# EAGLE design IrSystem (EAGLE 5.11)
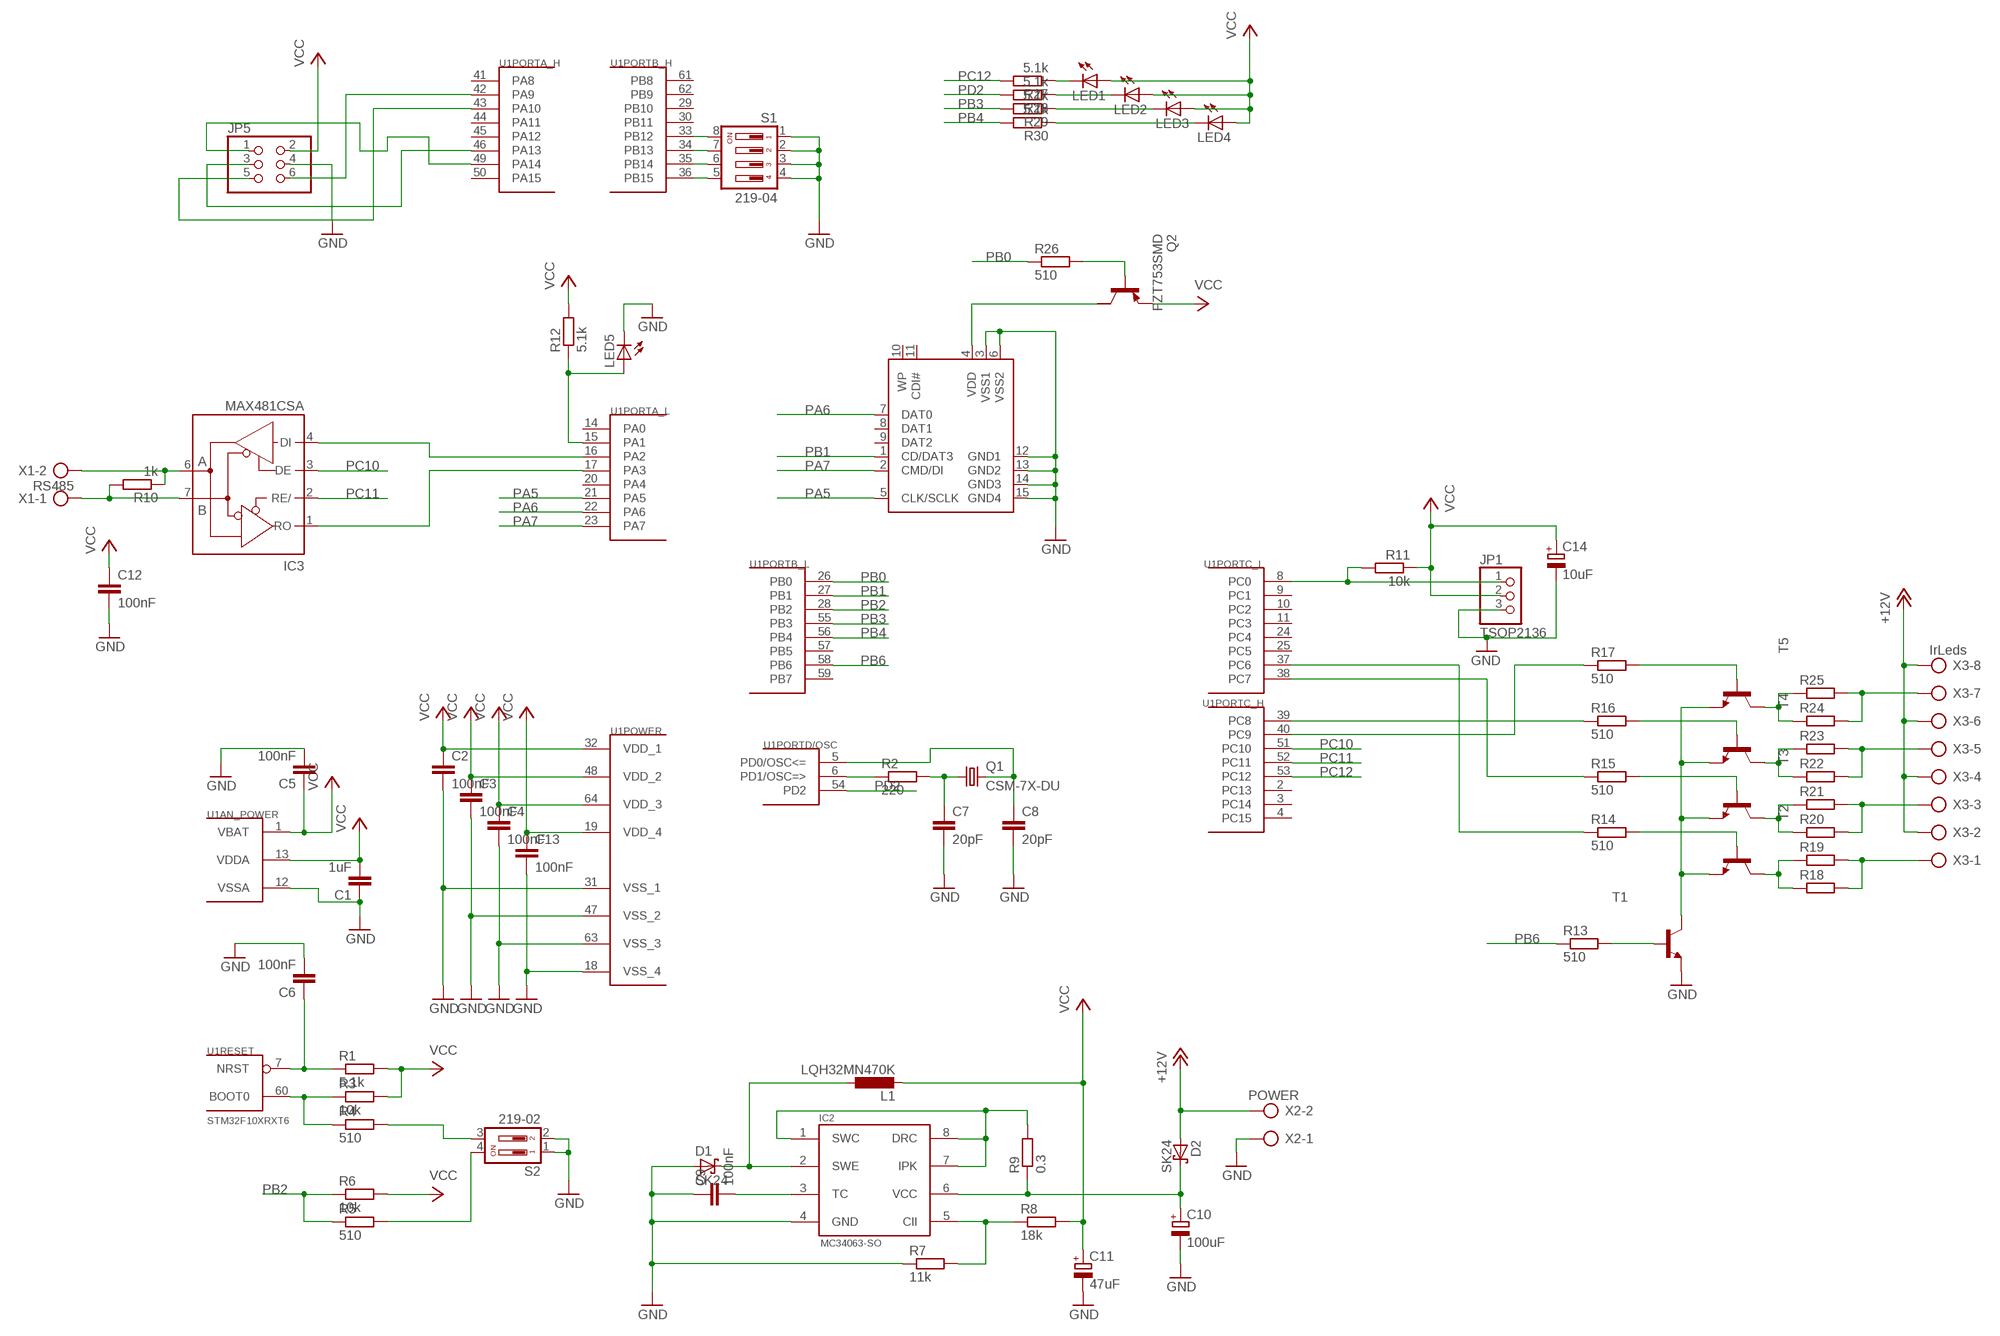
[diagram p0: schematic, sheet 1]

## Parts
C1  1uF  C-EUC0805  [C0805]
C2  100nF  C-EUC0805  [C0805]
C3  100nF  C-EUC0805  [C0805]
C4  100nF  C-EUC0805  [C0805]
C5  100nF  C-EUC0805  [C0805]
C6  100nF  C-EUC0805  [C0805]
C7  20pF  C-EUC0805  [C0805]
C8  20pF  C-EUC0805  [C0805]
C9  100nF  C-EUC0805  [C0805]
C10  100uF  CPOL-EUUD-6,3X7,7  [UD-6,3X7,7_NICHICON]
C11  47uF  CPOL-EUUD-6,3X7,7  [UD-6,3X7,7_NICHICON]
C12  100nF  C-EUC0805  [C0805]
C13  100nF  C-EUC0805  [C0805]
C14  10uF  CPOL-EUUD-6,3X7,7  [UD-6,3X7,7_NICHICON]
D1  SK24  SCHOTTKY-DIODESMD  [SMB]
D2  SK24  SCHOTTKY-DIODESMD  [SMB]
IC2  MC34063-SO  [SO8]
IC3  MAX481CSA  [SO08]
JP1  TSOP2136  PINHD-1X3  [1X03]
JP5  PINHD-2X3  [2X03]
L1  LQH32MN470K  L-EUL1812  [L1812]
LED1  LEDCHIPLED_1206  [CHIPLED_1206]
LED2  LEDCHIPLED_1206  [CHIPLED_1206]
LED3  LEDCHIPLED_1206  [CHIPLED_1206]
LED4  LEDCHIPLED_1206  [CHIPLED_1206]
LED5  LED5MM  [LED5MM]
Q1  CSM-7X-DU  [CSM-7X-DU]
Q2  FZT753SMD  [SOT223]
R1  5.1k  R-EU_R0805  [R0805]
R2  220  R-EU_R0805  [R0805]
R3  10k  R-EU_R0805  [R0805]
R4  510  R-EU_R0805  [R0805]
R5  510  R-EU_R0805  [R0805]
R6  10k  R-EU_R0805  [R0805]
R7  11k  R-EU_R0805  [R0805]
R8  18k  R-EU_R0805  [R0805]
R9  0.3  R-EU_R1206  [R1206]
R10  1k  R-EU_R1206  [R1206]
R11  10k  R-EU_R0805  [R0805]
R12  5.1k  R-EU_R0805  [R0805]
R13  510  R-EU_R0805  [R0805]
R14  510  R-EU_R0805  [R0805]
R15  510  R-EU_R0805  [R0805]
R16  510  R-EU_R0805  [R0805]
R17  510  R-EU_R0805  [R0805]
R18  R-EU_M1206  [M1206]
R19  R-EU_M1206  [M1206]
R20  R-EU_M1206  [M1206]
R21  R-EU_M1206  [M1206]
R22  R-EU_M1206  [M1206]
R23  R-EU_M1206  [M1206]
R24  R-EU_M1206  [M1206]
R25  R-EU_M1206  [M1206]
R26  510  R-EU_R0805  [R0805]
R27  5.1k  R-EU_R0805  [R0805]
R28  5.1k  R-EU_R0805  [R0805]
R29  5.1k  R-EU_R0805  [R0805]
R30  5.1k  R-EU_R0805  [R0805]
S1  219-04  [CTS-219-04]
S2  219-02  [CTS-219-02]
T1  -NPN-SOT223  [SOT223]
T2  -NPN-SOT223  [SOT223]
T3  -NPN-SOT223  [SOT223]
T4  -NPN-SOT223  [SOT223]
T5  -NPN-SOT223  [SOT223]
U1  STM32F10XRXT6  [TQFP64]
U$1  SDCARDVAR2  [SDCMF-10915W010]
X1  RS485  AK500/2  [AK500/2]
X2  POWER  AK500/2  [AK500/2]
X3  IrLeds  AK500/8  [AK500/8]

## Nets
+12V: D2.A X2.2 X3.2 X3.4 X3.6 X3.8
GND: C1.1 C2.2 C3.2 C4.2 C5.2 C6.2 C7.2 C8.2 C9.1 C10.- C11.- C12.2 C13.2 C14.- D1.A IC2.4(GND) JP1.3 JP5.4 LED5.K(C) R7.1 S1.1 S1.2 S1.3 S1.4 S2.1 S2.2 T1.3(E) U1.12(AN_POWER:VSSA) U1.18(POWER:VSS_4) U1.31(POWER:VSS_1) U1.47(POWER:VSS_2) U1.63(POWER:VSS_3) U$1.3(VSS1) U$1.6(VSS2) U$1.12(GND1) U$1.13(GND2) U$1.14(GND3) U$1.15(GND4) X2.1
N$1: S1.5 U1.36(PORTB_H:PB15)
N$2: R2.1 U1.6(PORTD/OSC:PD1/OSC=>)
N$3: C6.1 R1.1 U1.7(RESET:NRST)
N$4: C7.1 Q1.1 R2.2
N$5: C8.1 Q1.2 U1.5(PORTD/OSC:PD0/OSC<=)
N$6: R3.1 R4.1 U1.60(RESET:BOOT0)
N$7: R4.2 S2.3
N$8: R5.2 S2.4
N$9: C9.2 IC2.3(TC)
N$10: C10.+ D2.C IC2.6(VCC) R9.1
N$11: R17.1 U1.40(PORTC_H:PC9)
N$12: IC2.5(CII) R7.2 R8.1
N$13: IC2.1(SWC) IC2.7(IPK) IC2.8(DRC) R9.2
N$14: IC3.7(B) R10.2 X1.1
N$15: IC3.6(A) R10.1 X1.2
N$16: D1.C IC2.2(SWE) L1.1
N$17: S1.6 U1.35(PORTB_H:PB14)
N$18: S1.7 U1.34(PORTB_H:PB13)
N$19: S1.8 U1.33(PORTB_H:PB12)
N$20: IC3.1(RO) U1.17(PORTA_L:PA3)
N$21: IC3.4(DI) U1.16(PORTA_L:PA2)
N$22: Q2.2(C) U$1.4(VDD)
N$23: JP5.3 U1.46(PORTA_H:PA13)
N$24: JP1.1 R11.2 U1.8(PORTC_L:PC0)
N$25: JP5.6 U1.42(PORTA_H:PA9)
N$26: JP5.5 U1.43(PORTA_H:PA10)
N$28: LED5.A R12.1 U1.15(PORTA_L:PA1)
N$29: T1.4(C) T2.3(E) T3.3(E) T4.3(E) T5.3(E)
N$30: R13.2 T1.1(B)
N$31: R14.2 T2.1(B)
N$32: R15.2 T3.1(B)
N$33: R16.2 T4.1(B)
N$34: R17.2 T5.1(B)
N$35: R18.1 R19.1 T2.4(C)
N$36: R16.1 U1.39(PORTC_H:PC8)
N$37: R18.2 R19.2 X3.1
N$38: R15.1 U1.38(PORTC_L:PC7)
N$39: R20.1 R21.1 T3.4(C)
N$40: R20.2 R21.2 X3.3
N$41: R22.2 R23.2 X3.5
N$42: R22.1 R23.1 T4.4(C)
N$43: R24.1 R25.1 T5.4(C)
N$44: R24.2 R25.2 X3.7
N$45: R14.1 U1.37(PORTC_L:PC6)
N$46: JP5.1 U1.49(PORTA_H:PA14)
N$50: LED1.C R27.1
N$51: LED2.C R28.1
N$52: LED3.C R29.1
N$53: LED4.C R30.1
N$60: Q2.1(B) R26.2
PA5: U1.21(PORTA_L:PA5) U$1.5(CLK/SCLK)
PA6: U1.22(PORTA_L:PA6) U$1.7(DAT0)
PA7: U1.23(PORTA_L:PA7) U$1.2(CMD/DI)
PB0: R26.1 U1.26(PORTB_L:PB0)
PB1: U1.27(PORTB_L:PB1) U$1.1(CD/DAT3)
PB2: R5.1 R6.1 U1.28(PORTB_L:PB2)
PB3: R29.2 U1.55(PORTB_L:PB3)
PB4: R30.2 U1.56(PORTB_L:PB4)
PB6: R13.1 U1.58(PORTB_L:PB6)
PC10: IC3.3(DE) U1.51(PORTC_H:PC10)
PC11: IC3.2(RE/) U1.52(PORTC_H:PC11)
PC12: R27.2 U1.53(PORTC_H:PC12)
PD2: R28.2 U1.54(PORTD/OSC:PD2)
VCC: C1.2 C2.1 C3.1 C4.1 C5.1 C11.+ C12.1 C13.1 C14.+ JP1.2 JP5.2 L1.2 LED1.A LED2.A LED3.A LED4.A Q2.3(E) R1.2 R3.2 R6.2 R8.2 R11.1 R12.2 U1.1(AN_POWER:VBAT) U1.13(AN_POWER:VDDA) U1.19(POWER:VDD_4) U1.32(POWER:VDD_1) U1.48(POWER:VDD_2) U1.64(POWER:VDD_3)
Unconnected: Q2.4(C/) U1.2(PORTC_H:PC13) U1.3(PORTC_H:PC14) U1.4(PORTC_H:PC15) U1.9(PORTC_L:PC1) U1.10(PORTC_L:PC2) U1.11(PORTC_L:PC3) U1.14(PORTA_L:PA0) U1.20(PORTA_L:PA4) U1.24(PORTC_L:PC4) U1.25(PORTC_L:PC5) U1.29(PORTB_H:PB10) U1.30(PORTB_H:PB11) U1.41(PORTA_H:PA8) U1.44(PORTA_H:PA11) U1.45(PORTA_H:PA12) U1.50(PORTA_H:PA15) U1.57(PORTB_L:PB5) U1.59(PORTB_L:PB7) U1.61(PORTB_H:PB8) U1.62(PORTB_H:PB9) U$1.8(DAT1) U$1.9(DAT2) U$1.10(WP) U$1.11(CDI#)

## Power pins joined to a net without a drawn wire
GND: IC3.5(GND)
VCC: IC3.8(VCC)

## Library data of the parts
C1-C9 C12 C13 = rcl:C-EU: CAPACITOR, European symbol
C10 C11 C14 = rcl:CPOL-EU: POLARIZED CAPACITOR, European symbol
D1 D2 = diode:SCHOTTKY-DIODE: Schottky Diode
IC2 = mc34063:MC34063-SO: DC/DC converter MC34063 in SO08.
IC3 = maxim:MAX481CSA: RS485 TRANSEIVER; MF: MAXIM; MPN: MAX481CSA; OC_FARNELL: unknown; OC_NEWARK: 90C3817
JP1 = pinhead:PINHD-1X3: PIN HEADER
JP5 = pinhead:PINHD-2X3: PIN HEADER
L1 = rcl:L-EU: INDUCTOR, European symbol
LED1-LED5 = led:LED: LED OSRAM: - CHIPLED LG R971, LG N971, LY N971, LG Q971, LY Q971, LO R971, LY R971 LH N974, LH R974 LS Q976, LO Q976, LY Q976 LO Q996 - Hyper CHIPLED LW Q18S LB Q993, LB Q99A, LB R99A - SideLED LS A670, LO A670, LY A670, LG A670, LP A670 LB A673, LV A673, LT A673, LW A673 LH A674 LY A675 LS A676, LA A676, LO A676, LY A676, LW A676 LS A679, LY A679, LG A679 - Hyper Micro SIDELED® LS Y876, LA Y876, LO Y876, LY Y876 LT Y87S - SmartLED LW L88C, LW L88S LB L89C, LB L89S, LG L890 LS L89K, LO L89K, LY L89K LS L896, LA L896, LO L896, LY L896 - TOPLED LS T670, LO T670, LY T670, LG T670, LP T670 LSG T670, LSP T670, LSY T670, LOP T670, LYG T670 LG T671, LOG T671, LSG T671 LB T673, LV T673, LT T673, LW T673 LH T674 LS T676, LA T676, LO T676, LY T676, LB T676, LH T676, LSB T676, LW T676 LB T67C, LV T67C, LT T67C, LS T67K, LO T67K, LY T67K, LW E67C LS E67B, LA E67B, LO E67B, LY E67B, LB E67C, LV E67C, LT E67C LW T67C LS T679, LY T679, LG T679 LS T770, LO T770, LY T770, LG T770, LP T770 LB T773, LV T773, LT T773, LW T773 LH T774 LS E675, LA E675, LY E675, LS T675 LS T776, LA T776, LO T776, LY T776, LB T776 LHGB T686 LT T68C, LB T68C - Hyper Mini TOPLED® LB M676 - Mini TOPLED Santana® LG M470 LS M47K, LO M47K, LY M47K Source: http://www.osram.convergy.de LUXEON: - LUMILED® LXK2-PW12-R00, LXK2-PW12-S00, LXK2-PW14-U00, LXK2-PW14-V00 LXK2-PM12-R00, LXK2-PM12-S00, LXK2-PM14-U00 LXK2-PE12-Q00, LXK2-PE12-R00, LXK2-PE12-S00, LXK2-PE14-T00, LXK2-PE14-U00 LXK2-PB12-K00, LXK2-PB12-L00, LXK2-PB12-M00, LXK2-PB14-N00, LXK2-PB14-P00, LXK2-PB14-Q00 LXK2-PR12-L00, LXK2-PR12-M00, LXK2-PR14-Q00, LXK2-PR14-R00 LXK2-PD12-Q00, LXK2-PD12-R00, LXK2-PD12-S00 LXK2-PH12-R00, LXK2-PH12-S00 LXK2-PL12-P00, LXK2-PL12-Q00, LXK2-PL12-R00 Source: www.luxeon.com KINGBRIGHT: KA-3528ASYC Source: www.kingbright.com
Q1 = crystal:CSM-7X-DU: SMD CRYSTAL Source: www.ecsxtal.com .. Crystal 3.6864MHz CSM_7X_DU.PDF; OC_FARNELL: unknown; OC_NEWARK: unknown
Q2 = transistor-pnp:FZT753SMD: PNP Transistor
R1-R30 = rcl:R-EU_: RESISTOR, European symbol
S1 = switch-dil:219-04*: Surface Mount DIP Switch Series 219 SMT CTS Electronic Components Sourc: www.ctscorp.com; OC_FARNELL: unknown; OC_NEWARK: unknown
S2 = switch-dil:219-02*: Surface Mount DIP Switch Series 219 SMT CTS Electronic Components Sourc: www.ctscorp.com; OC_FARNELL: unknown; OC_NEWARK: unknown
T1-T5 = transistor-neu-to92:*-NPN-: NPN Transistror
U1 = stm32:STM32F10XRXT6: STM32F101/103 64pin LQFP
U$1 = kingfont_sdcmf10915w010_covek:SDCARD: SD card connector KINGFONT SDCMF-10915W010
X1 X2 = con-ptr500:AK500/2: CONNECTOR; OC_FARNELL: unknown; OC_NEWARK: unknown
X3 = con-ptr500:AK500/8: CONNECTOR; OC_FARNELL: unknown; OC_NEWARK: unknown

## Board
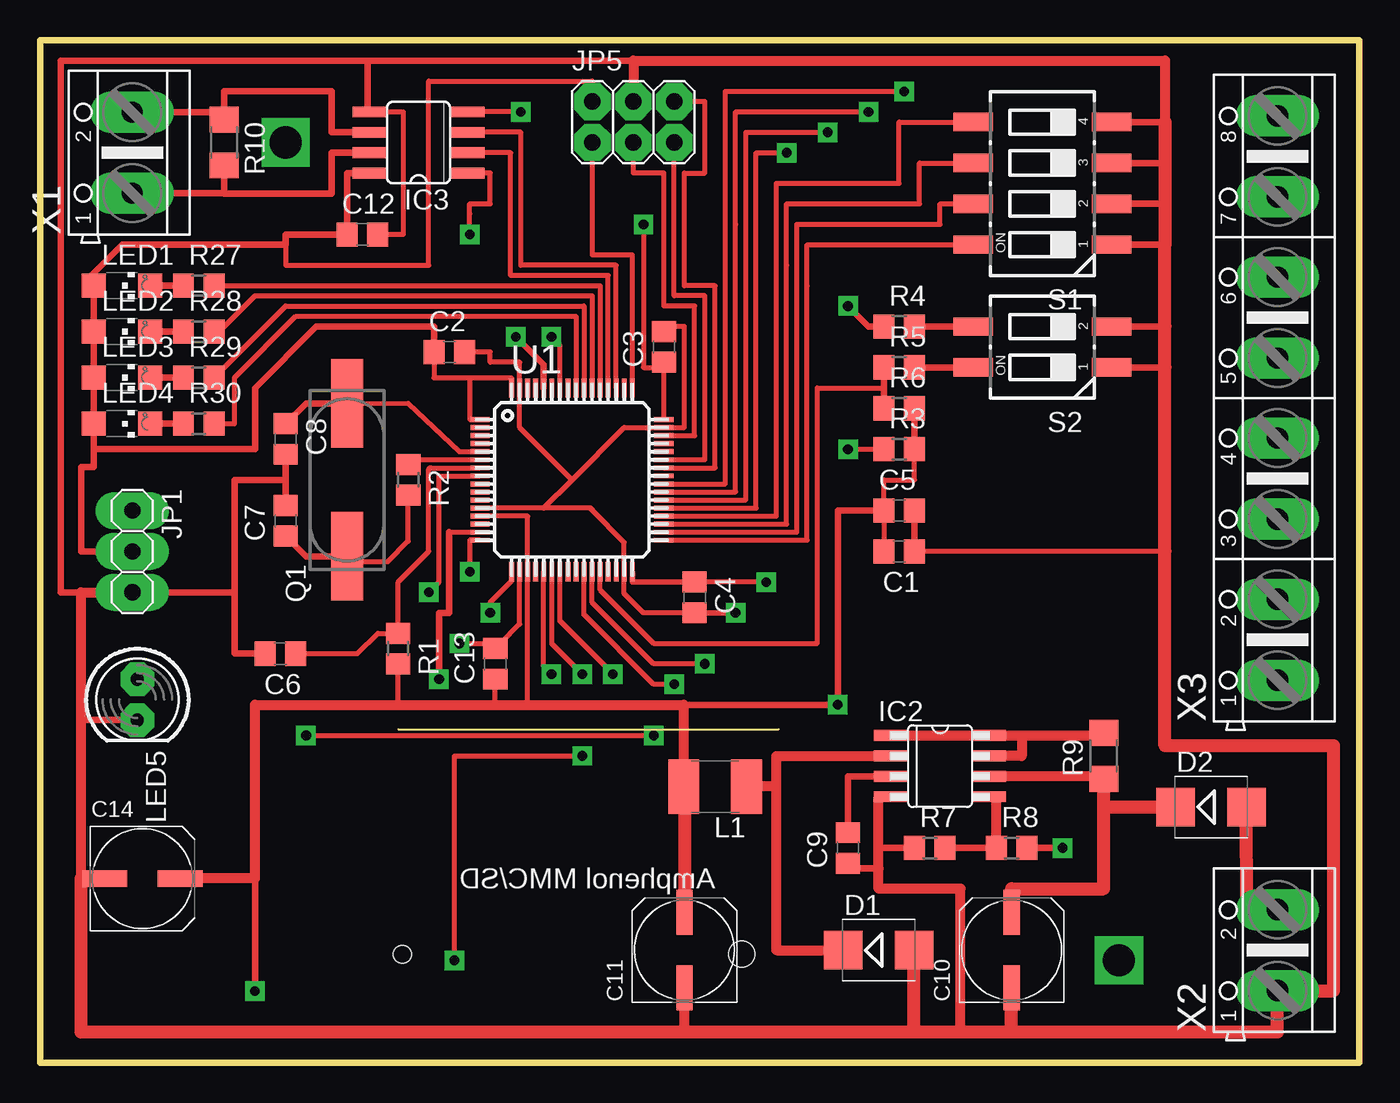
[diagram p1: board, top side]
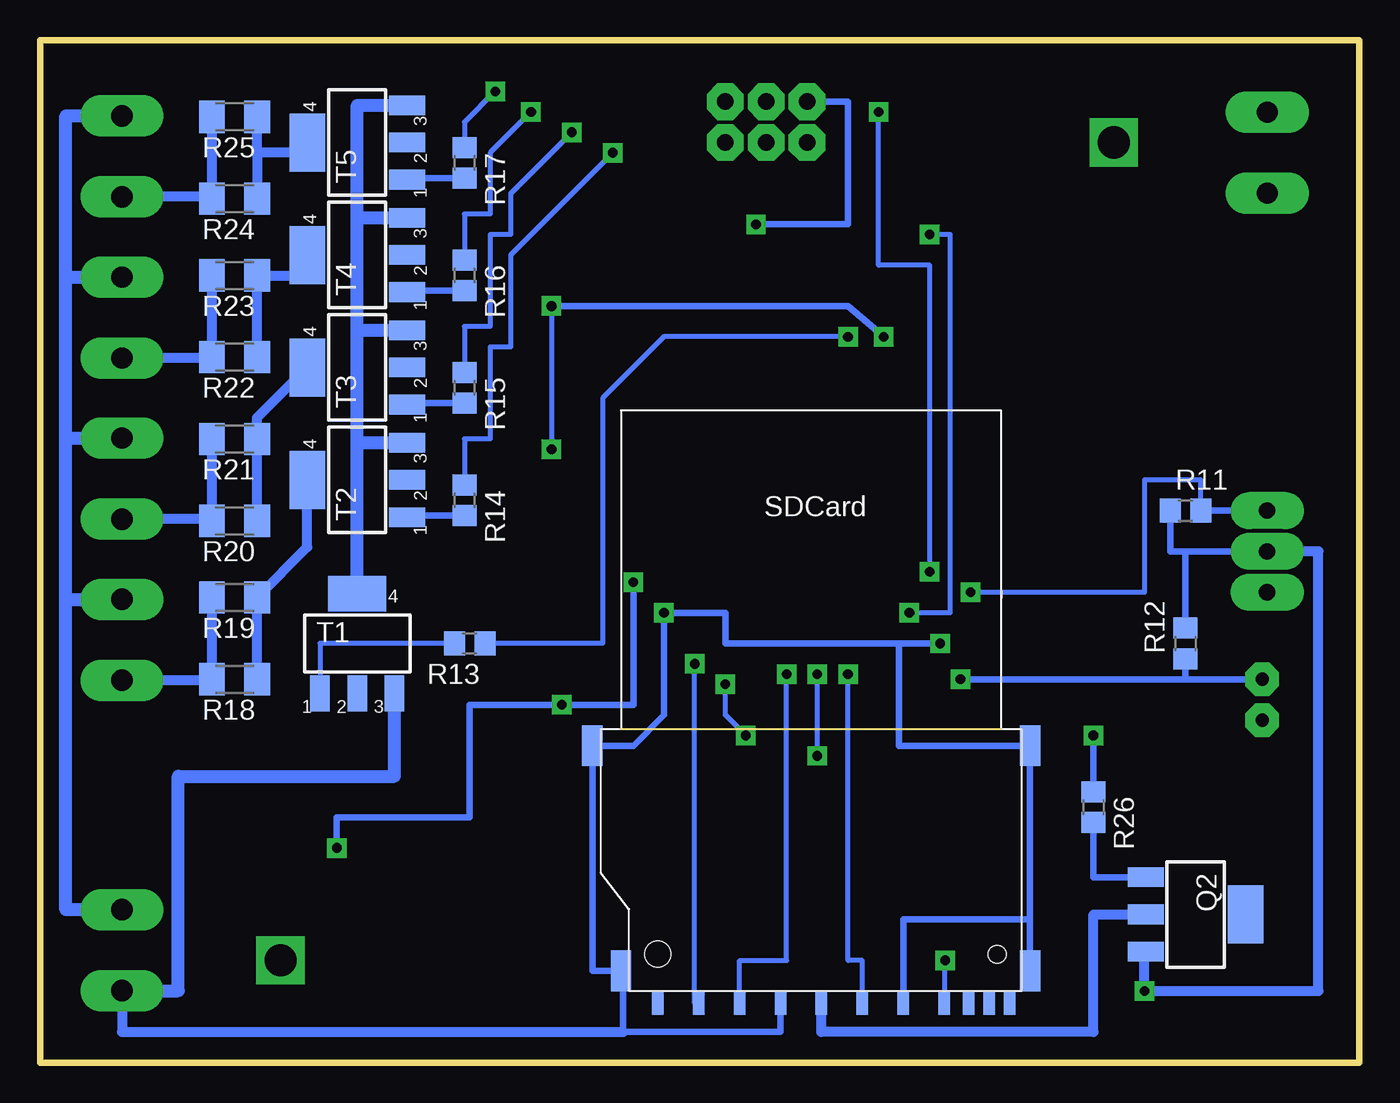
[diagram p2: board, bottom side, seen from below]

Size 81.92 x 63.5 mm. Coordinates in mm from the lower left corner, seen from the top.
Outline: 0,0 81.92,0 81.92,63.5 0,63.5 0,0
Copper layers (1*16): Top 0.035mm / dielectric 1.5mm / Bottom 0.035mm
Design rules "default": minimum track width 20mil, minimum drill 32mil, track to track 12mil, track to pad 12mil, pad to pad 12mil, via to via 12mil, smd to smd 8mil, copper to edge 40mil, drill to drill 40mil, minimum pad ring 25mil, minimum via ring 12mil, stop-mask expansion 4mil, vias tented up to drill 0mil, thermal gap 10mil

### Footprints (pad centres in the part's own frame; a part is rotated, then mirrored left to right if it is on the bottom)
C0805 = smd 1.3 x 1.5: 1 -0.95,0; 2 0.95,0
UD-6,3X7,7_NICHICON = smd 2.8 x 1: + 2.35,0; - -2.35,0
SMB = smd 2.4 x 2.4: A 2.2,0; C -2.2,0
SO8 = smd 0.66 x 2.032: 1 -1.905,-3.073; 2 -0.635,-3.073; 3 0.635,-3.073; 4 1.905,-3.073; 5 1.905,3.073; 6 0.635,3.073; 7 -0.635,3.073; 8 -1.905,3.073
SO08 = smd 0.66 x 2.032: 1 -1.905,-3.073; 2 -0.635,-3.073; 3 0.635,-3.073; 4 1.905,-3.073; 5 1.905,3.073; 6 0.635,3.073; 7 -0.635,3.073; 8 -1.905,3.073
1X03 = drill 1.016 long: 1 -2.54,0; 2 0,0; 3 2.54,0
2X03 = drill 1.016 octagon: 1 -2.54,-1.27; 2 -2.54,1.27; 3 0,-1.27; 4 0,1.27; 5 2.54,-1.27; 6 2.54,1.27
L1812 = smd 1.9 x 3.4: 1 -1.95,0; 2 1.95,0
CHIPLED_1206 = smd 1.5 x 1.5: A 0,-1.75; C 0,1.75
LED5MM = drill 0.813 octagon: A -1.27,0; K 1.27,0
CSM-7X-DU = smd 5.5 x 2: 1 -4.75,0; 2 4.75,0
SOT223 = smd 1.219 x 2.235: 1 -2.311,-3.099; 2 0,-3.099; 3 2.311,-3.099 | smd 3.6 x 2.2: 4 0,3.099
R0805 = smd 1.3 x 1.5: 1 -0.95,0; 2 0.95,0
R1206 = smd 1.6 x 1.803: 1 -1.422,0; 2 1.422,0
M1206 = smd 1.6 x 2: 1 -1.4,0; 2 1.4,0
CTS-219-04 = smd 1.13 x 2.44: 1 -3.81,-4.3; 2 -1.27,-4.3; 3 1.27,-4.3; 4 3.81,-4.3; 5 3.81,4.3; 6 1.27,4.3; 7 -1.27,4.3; 8 -3.81,4.3
CTS-219-02 = smd 1.13 x 2.44: 1 -1.27,-4.3; 2 1.27,-4.3; 3 1.27,4.3; 4 -1.27,4.3
TQFP64 = smd 1.2 x 0.3: 1 -5.7,3.75; 2 -5.7,3.25; 3 -5.7,2.75; 4 -5.7,2.25; 5 -5.7,1.75; 6 -5.7,1.25; 7 -5.7,0.75; 8 -5.7,0.25; 9 -5.7,-0.25; 10 -5.7,-0.75; 11 -5.7,-1.25; 12 -5.7,-1.75; 13 -5.7,-2.25; 14 -5.7,-2.75; 15 -5.7,-3.25; 16 -5.7,-3.75; 33 5.7,-3.75; 34 5.7,-3.25; 35 5.7,-2.75; 36 5.7,-2.25; 37 5.7,-1.75; 38 5.7,-1.25; 39 5.7,-0.75; 40 5.7,-0.25; 41 5.7,0.25; 42 5.7,0.75; 43 5.7,1.25; 44 5.7,1.75; 45 5.7,2.25; 46 5.7,2.75; 47 5.7,3.25; 48 5.7,3.75 | smd 0.3 x 1.2: 17 -3.75,-5.7; 18 -3.25,-5.7; 19 -2.75,-5.7; 20 -2.25,-5.7; 21 -1.75,-5.7; 22 -1.25,-5.7; 23 -0.75,-5.7; 24 -0.25,-5.7; 25 0.25,-5.7; 26 0.75,-5.7; 27 1.25,-5.7; 28 1.75,-5.7; 29 2.25,-5.7; 30 2.75,-5.7; 31 3.25,-5.7; 32 3.75,-5.7; 49 3.75,5.7; 50 3.25,5.7; 51 2.75,5.7; 52 2.25,5.7; 53 1.75,5.7; 54 1.25,5.7; 55 0.75,5.7; 56 0.25,5.7; 57 -0.25,5.7; 58 -0.75,5.7; 59 -1.25,5.7; 60 -1.75,5.7; 61 -2.25,5.7; 62 -2.75,5.7; 63 -3.25,5.7; 64 -3.75,5.7
SDCMF-10915W010 = smd 0.711 x 1.422: 1 7.366,13.462; 2 4.826,13.462; 3 2.286,13.462; 4 -0.254,13.462; 5 -2.794,13.462; 6 -5.334,13.462; 7 -7.874,13.462; 8 -9.398,13.462; 9 9.906,13.462; 10 -11.938,13.462; 11 -10.668,13.462 | smd 1.27 x 2.54: 12 12.192,11.43; 13 13.97,-2.54; 14 -13.208,-2.54; 15 -13.208,11.43 | hole 1.6: 9.906,10.414 | hole 1.1: -11.176,10.414
AK500/2 = drill 1.321 long: 1 -2.515,0; 2 2.515,0
AK500/8 = drill 1.321 long: 1 -17.526,0; 2 -12.497,0; 3 -7.518,0; 4 -2.489,0; 5 2.489,0; 6 7.518,0; 7 12.497,0; 8 17.526,0

### Placement (x,y rotation side)
C1  53.34,31.75 180 top
C2  25.4,44.13 0 top
C3  38.73,44.45 90 top
C4  40.64,28.89 270 top
C5  53.34,34.29 0 top
C6  14.92,25.4 180 top
C7  15.24,33.66 90 top
C8  15.24,38.73 270 top
C9  50.16,13.34 90 top
C10  60.33,6.99 90 top
C11  40.01,6.99 90 top
C12  20,51.44 0 top
C13  28.26,24.77 90 top
C14  6.35,11.43 0 top
D1  52.07,6.99 0 top
D2  72.71,15.88 0 top
IC2  55.88,18.41 270 top
IC3  23.5,57.15 90 top
JP1  5.71,31.75 270 top
JP5  36.83,58.42 0 top
L1  41.91,17.14 180 top
LED1  5.08,48.26 270 top
LED2  5.08,45.4 270 top
LED3  5.08,42.55 270 top
LED4  5.08,39.69 270 top
LED5  6.03,22.54 270 top
Q1  19.05,36.2 90 top
Q2  10.16,9.21 270 bottom
R1  22.23,25.72 270 top
R2  22.86,36.2 270 top
R3  53.34,38.1 0 top
R4  53.34,45.72 0 top
R5  53.34,43.18 0 top
R6  53.34,40.64 0 top
R7  55.24,13.34 0 top
R8  60.33,13.34 0 top
R9  66.04,19.05 90 top
R10  11.43,57.15 270 top
R11  10.79,34.29 0 bottom
R12  10.79,26.04 90 bottom
R13  55.24,26.04 180 bottom
R14  55.56,34.92 270 bottom
R15  55.56,41.91 270 bottom
R16  55.56,48.9 270 bottom
R17  55.56,55.88 270 bottom
R18  69.85,23.81 180 bottom
R19  69.85,28.89 180 bottom
R20  69.85,33.66 180 bottom
R21  69.85,38.73 180 bottom
R22  69.85,43.81 180 bottom
R23  69.85,48.9 180 bottom
R24  69.85,53.66 180 bottom
R25  69.85,58.74 180 bottom
R26  16.51,15.88 270 bottom
R27  9.84,48.26 0 top
R28  9.84,45.4 0 top
R29  9.84,42.55 0 top
R30  9.84,39.69 0 top
S1  62.23,54.61 90 top
S2  62.23,44.45 90 top
T1  62.23,26.04 0 bottom
T2  62.23,36.2 90 bottom
T3  62.23,43.18 90 bottom
T4  62.23,50.16 90 bottom
T5  62.23,57.15 90 bottom
U1  33.02,36.2 0 top
U$1  33.66,17.14 180 bottom
X1  5.71,56.52 90 top
X2  76.83,6.99 90 top
X3  76.83,41.27 90 top

### Tracks (layer width: path | path; a pad name or v marks a point on that pad's centre or on a via)
+12V
  Top 0.813: X2.2 74.93,9.5 D2.A
  Bottom 0.813: 80.33,28.78 80.33,9.5 X2.2 | 80.33,28.78 X3.2 | 80.33,28.78 80.33,38.79 | X3.8 80.33,58.8 80.33,48.79 | 80.33,48.79 X3.6 | 80.33,38.79 80.33,48.79 | 80.33,38.79 X3.4
GND  (via drill 0.6)
  Top 0.305: 31.27,34.45 U1.12 | 31.27,34.45 33.02,36.2 | 33.02,36.2 29.77,39.45 U1.63 29.77,43.5 27.94,43.5 27.94,44.13 C2.2 26.35,44.45 26.04,44.45 | 33.02,36.2 36.27,39.45 U1.47 40.01,39.45 40.01,45.72 38.73,45.72 C3.2 | 34.29,34.29 34.13,34.45 | 69.85,31.75 C1.1 | C13.2 | 28.57,26.04 C13.2 | C13.2 27.94,25.4 27.94,26.04 v26.04,26.04 28.57,26.04 | U1.18 29.77,27.23 28.57,26.04 | 34.13,34.45 31.27,34.45 | 34.29,34.29 arc90 34.13,34.45 | 34.29,34.29 36.27,32.31 U1.31 36.27,29.14 37.46,27.94 C4.2 v43.18,27.94 | 52.07,16.51 IC2.4 | C12.2 22.54,51.44 22.54,59.05 IC3.5
  Top 0.406: C1.1 C5.2 | 69.85,58.42 S1.4 | 69.85,55.88 S1.3 | 69.85,53.34 S1.2 | 69.85,50.8 S1.1 | 69.85,45.72 S2.2 | 69.85,43.18 S2.1 | 52.07,13.34 R7.1 | C9.1 50.16,12.06 52.07,12.06 | 2.54,11.43 C14.- | 2.54,21.27 LED5.K | JP1.3 12.06,29.21 | 12.06,29.21 12.06,36.2 15.24,36.2 | 2.54,29.21 1.27,29.21 1.27,62.23 20.32,62.23 | 20.32,62.23 36.83,62.23 | 12.06,29.21 12.06,25.4 C6.2 | 15.24,36.2 C7.2 | 15.24,36.2 C8.2 | IC3.5 20.32,59.05 20.32,62.23
  Top 0.61: 40.01,1.91 C11.- | 52.07,16.51 52.07,13.34 52.07,12.06 52.07,10.79 57.15,10.79 57.15,1.91 | 2.54,11.43 2.54,21.27 2.54,29.21 JP1.3 | JP5.4 36.83,62.23 69.85,62.23 69.85,58.42
  Top 0.813: 60.33,1.91 76.83,1.91 X2.1 80.33,4.47 80.33,19.68 69.85,19.68 69.85,31.75 69.85,43.18 69.85,45.72 69.85,50.8 69.85,53.34 69.85,55.88 69.85,58.42 | 60.33,1.91 C10.- | 2.54,11.43 2.54,1.91 40.01,1.91 54.27,1.91 | 60.33,1.91 57.15,1.91 54.27,1.91 | 54.27,1.91 D1.A
  Bottom 0.305: 45.72,5.71 U$1.12
  Bottom 0.406: U$1.12 47.62,5.71 U$1.13 45.09,19.68 43.18,21.59 v43.18,27.94 39.37,27.94 39.37,26.04 28.57,26.04 | 20.45,8.89 U$1.15 | 20.45,8.89 U$1.14 28.57,19.68 28.57,26.04 | U$1.3 35.94,1.91 45.72,1.91 45.72,5.71 | 28.57,26.04 v26.04,26.04 | U$1.6 28.32,8.89 20.45,8.89
  Bottom 0.61: X2.1 76.83,1.91 45.72,1.91
  Bottom 0.813: X2.1 73.34,4.47 73.34,17.78 59.92,17.78 T1.3
N$1
  Top 0.305: S1.5 53.34,58.42 53.34,54.61 45.72,54.61 45.72,50.16 45.72,33.95 U1.36
N$2
  Top 0.305: U1.6 23.16,37.45 arc90 R2.1
N$3
  Top 0.305: U1.7 24.25,36.95 arc90 24.13,36.83 24.13,31.75 22.23,29.84 R1.1 20.95,26.67 19.68,25.4 C6.1
N$4
  Top 0.305: 19.04,31.43 arc90 Q1.1 19.38,31.11 21.59,31.11 22.86,32.38 R2.2
  Top 0.406: Q1.1 16.5,31.45 C7.1
N$5
  Top 0.305: U1.5 26.04,37.95 22.86,40.96 Q1.2
  Top 0.406: Q1.2 16.5,40.95 C8.1
N$6  (via drill 0.6)
  Top 0.305: v50.16,38.1 R3.1
  Top 0.406: R4.1 51.44,45.72 v50.16,46.99 | v29.53,45.09 31.27,43.34 U1.60
  Bottom 0.305: v50.16,46.99 v50.16,38.1
  Bottom 0.406: v50.16,46.99 31.75,46.99 v29.53,45.09
N$7
  Top 0.406: R4.2 S2.3
N$8
  Top 0.406: R5.2 S2.4
N$9
  Top 0.406: C9.2 50.16,17.78 IC2.3
N$10
  Top 0.406: R9.1 66.04,17.78
  Top 0.61: 66.04,17.78 IC2.6
  Top 0.813: C10.+ 60.33,10.79 66.04,10.79 66.04,15.88 | 66.04,15.88 R9.1 | 66.04,15.88 D2.C
N$11  (via drill 0.6)
  Top 0.305: v53.66,60.33 42.55,60.33 42.55,52.7 42.55,35.95 U1.40
  Bottom 0.305: R17.1 55.56,58.42 v53.66,60.33
N$12
  Top 0.406: 59.38,16.51 IC2.5 | R7.2 R8.1
  Top 0.61: R8.1 59.38,16.51
N$13
  Top 0.406: 66.04,20.32 R9.2
  Top 0.61: IC2.1 IC2.8 60.96,20.32 | 60.96,20.32 60.96,19.05 IC2.7 | 60.96,20.32 66.04,20.32
N$14
  Top 0.406: X1.1 11.43,54 | IC3.7 18.1,56.52 18.1,53.98 11.43,53.98 11.43,54 | 11.43,54 R10.2
N$15
  Top 0.406: X1.2 10.79,59.03 R10.1 11.43,60.33 18.1,60.33 18.1,57.78 IC3.6
N$16
  Top 0.61: D1.C 45.72,6.99 45.72,17.14 | 45.72,17.14 L1.1 | IC2.2 45.72,19.05 45.72,17.14
N$17
  Top 0.305: S1.6 54.61,55.88 54.61,53.34 46.35,53.34 46.35,49.53 46.35,33.45 U1.35
N$18
  Top 0.305: S1.7 55.88,53.34 55.88,52.07 46.99,52.07 46.99,48.9 46.99,32.95 U1.34
N$19
  Top 0.305: S1.8 47.62,50.8 47.62,48.26 47.62,32.45 U1.33
N$20  (via drill 0.6)
  Top 0.305: IC3.1 27.94,55.24 27.94,53.34 26.67,53.34 26.67,52.7 v26.67,51.44 | v27.94,27.94 27.94,28.57 29.27,29.91 U1.17
  Bottom 0.305: v26.67,51.44 25.4,51.44 25.4,27.94 v27.94,27.94
N$21  (via drill 0.6)
  Top 0.305: v29.84,59.05 IC3.4 | v26.67,30.48 26.67,32.45 U1.16
  Bottom 0.305: v26.67,30.48 26.67,49.53 29.84,49.53 v29.84,59.05
N$22
  Bottom 0.61: Q2.2 16.51,9.21 16.51,1.91 33.4,1.91 U$1.4
N$23
  Top 0.305: JP5.3 36.83,55.24 38.73,55.24 38.73,46.99 40.64,46.99 40.64,38.95 U1.46
N$24  (via drill 0.6)
  Top 0.305: U1.8 24.77,36.45 24.77,29.84 v24.13,29.21
  Bottom 0.305: v24.13,29.21 13.34,29.21 13.34,36.2 9.85,36.2 R11.2
  Bottom 0.406: JP1.1 R11.2
N$25
  Top 0.305: JP5.6 41.27,59.69 41.27,55.24 40.01,55.24 40.01,48.26 41.91,48.26 41.91,36.95 U1.42
N$26
  Top 0.305: JP5.5 39.37,47.62 41.27,47.62 41.27,37.45 U1.43
N$27
  Top 0.305: 40.64,27.94 43.18,27.94
N$28  (via drill 0.6)
  Top 0.305: 25.4,32.95 U1.15
  Top 0.406: 25.4,32.95 25.4,27.94 24.77,27.94 v24.77,23.81
  Bottom 0.305: R12.1 arc90 11.12,24.77
  Bottom 0.406: LED5.A 10.79,23.81 | 10.79,23.81 R12.1 | 10.79,23.81 v24.77,23.81
N$29
  Bottom 0.813: 62.23,38.51 T2.3 | 62.23,45.49 T3.3 | 62.23,38.51 62.23,45.49 | 62.23,52.48 T4.3 | 62.23,45.49 62.23,52.48 | T1.4 62.23,38.51 | 62.23,52.48 62.23,59.46 T5.3
N$30
  Bottom 0.305: R13.2 64.54,26.04 T1.1
N$31
  Bottom 0.406: T2.1 59.13,33.98 R14.2
N$32
  Bottom 0.406: T3.1 59.13,40.96 R15.2
N$33
  Bottom 0.406: T4.1 59.13,47.95 R16.2
N$34
  Bottom 0.406: T5.1 59.13,54.93 R17.2
N$35
  Bottom 0.61: R18.1 R19.1 65.33,32.01 65.33,36.83 T2.4
N$36  (via drill 0.6)
  Top 0.305: v51.44,59.05 43.18,59.05 43.18,52.07 43.18,35.45 U1.39
  Bottom 0.305: R16.1 55.56,52.7 53.98,52.7 53.98,56.52 v51.44,59.05
N$37
  Bottom 0.406: R18.2 71.25,23.75
  Bottom 0.61: R18.2 R19.2 | 71.25,23.75 X3.1
N$38  (via drill 0.6)
  Top 0.305: v48.9,57.78 43.81,57.78 43.81,51.44 43.81,34.95 U1.38
  Bottom 0.305: R15.1 55.56,45.72 53.98,45.72 53.98,51.44 52.7,51.44 52.7,53.98 v48.9,57.78
N$39
  Bottom 0.61: R20.1 R21.1 68.45,40.06 T3.4 65.33,44.45
N$40
  Bottom 0.406: R20.2 71.25,33.76
  Bottom 0.61: R20.2 R21.2 | 71.25,33.76 X3.3
N$41
  Bottom 0.406: R22.2 71.57,43.76
  Bottom 0.61: R22.2 R23.2 | 71.57,43.76 X3.5
N$42
  Bottom 0.61: T4.4 65.33,48.9 R23.1 R22.1
N$43
  Bottom 0.61: 68.45,56.52 R25.1 | T5.4 65.33,56.52 | 65.33,56.52 65.33,55.88 | 68.45,56.52 R24.1 | 65.33,56.52 68.45,56.52
N$44
  Bottom 0.406: R24.2 71.25,53.77
  Bottom 0.61: R24.2 R25.2 | 71.25,53.77 X3.7
N$45  (via drill 0.6)
  Top 0.305: v46.35,56.52 44.45,56.52 44.45,34.45 U1.37
  Bottom 0.305: R14.1 55.56,38.73 53.98,38.73 53.98,44.45 52.7,44.45 52.7,50.16 v46.35,56.52
N$46
  Top 0.305: U1.49 36.77,50.16 34.29,50.16 JP5.1
N$47  (via drill 2)
  other vias: 66.99,6.35
N$48  (via drill 2)
  other vias: 15.24,57.15
N$50
  Top 0.406: LED1.C R27.1
N$51
  Top 0.406: LED2.C R28.1
N$52
  Top 0.406: LED3.C R29.1
N$53
  Top 0.406: LED4.C R30.1
N$60
  Bottom 0.406: Q2.1 16.51,11.52 R26.2
PA5  (via drill 0.6)
  Top 0.305: U1.21 31.27,24.61 v31.75,24.13
  Bottom 0.305: v31.75,24.13 31.75,6.35 30.86,6.35 U$1.5
PA6  (via drill 0.6)
  Top 0.305: U1.22 31.77,26.02 v33.66,24.13 | v33.66,19.05 25.72,19.05 v25.72,6.35
  Bottom 0.305: v33.66,19.05 v33.66,24.13 | U$1.7 25.72,3.68 v25.72,6.35
PA7  (via drill 0.6)
  Top 0.305: U1.23 32.27,27.42 v35.56,24.13
  Bottom 0.305: v35.56,24.13 35.56,6.35 38.48,6.35 U$1.2
PB0  (via drill 0.6)
  Top 0.305: U1.26 33.77,27.82 38.1,23.5 v39.37,23.5 | v16.51,20.32 v38.1,20.32
  Bottom 0.305: v39.37,23.5 39.37,21.59 v38.1,20.32
  Bottom 0.406: R26.1 v16.51,20.32
PB1  (via drill 0.6)
  Top 0.305: U1.27 34.27,28.59 38.1,24.77 v41.27,24.77
  Bottom 0.305: v41.27,24.77 41.27,3.68 U$1.1
PB2
  Top 0.305: U1.28 34.77,29.36 38.1,26.04 48.26,26.04 48.26,41.91 52.39,41.91
  Top 0.406: R6.1 52.39,41.91 R5.1
PB3
  Top 0.305: U1.55 33.77,46.99 15.24,46.99 R29.2
PB4
  Top 0.305: U1.56 33.27,46.35 15.88,46.35 12.06,42.55 12.06,39.69 R30.2
PB6  (via drill 0.6)
  Top 0.305: U1.58 32.27,44.56 v31.75,45.09
  Bottom 0.305: v31.75,45.09 43.18,45.09 46.99,41.27 46.99,26.04 R13.1
PC10
  Top 0.305: IC3.3 29.84,57.78 29.84,49.53 35.77,49.53 U1.51
PC11
  Top 0.305: IC3.2 29.21,56.52 29.21,48.9 35.27,48.9 U1.52
PC12
  Top 0.305: R27.2 34.77,48.26 U1.53
PD2
  Top 0.305: U1.54 34.27,47.62 13.34,47.62 11.11,45.4 R28.2
VCC  (via drill 0.6)
  Top 0.305: 22.23,22.23 R1.2 | U1.1 26.67,39.95 26.67,42.55 | 26.67,42.55 29.27,42.55 U1.64 | 26.67,42.55 24.45,42.55 C2.1 24.77,43.81 | U1.13 30.27,33.95 U1.19 30.27,22.23 | U1.48 C3.1 38.73,43.18 37.47,43.18 v37.47,52.07 | C4.1 36.77,29.84 U1.32 36.77,29.84 v45.09,29.84 | C1.2 C5.1 52.39,36.2 54.29,36.2 R3.2 | 28.26,22.23 C13.1 | JP5.2 34.29,60.96 24.13,60.96 24.13,49.53 15.24,49.53 15.24,50.8 | 3.17,48.9 3.17,48.41 LED1.A
  Top 0.406: LED1.A LED2.A LED3.A LED4.A 3.33,38.1 | R3.2 R6.2 | 40.01,17.14 L1.2 39.96,11.43 | v63.5,13.34 R8.2 | 39.96,22.23 v49.53,22.23 49.53,34.29 C5.1 | JP1.2 2.54,31.75 2.54,36.98 3.33,36.98 3.33,38.1 | C2.1 24.45,45.72 17.14,45.72 13.34,41.91 13.34,38.1 3.33,38.1 | v13.34,4.45 13.34,11.43 | 3.17,48.9 5.08,50.8 15.24,50.8 15.24,51.44 17.14,51.44 C12.1 19.05,55.24 IC3.8
  Top 0.61: L1.2 39.96,22.23 30.27,22.23 28.26,22.23 22.23,22.23 13.34,22.23 13.34,11.43 C14.+
  Top 0.813: 40.01,17.14 C11.+
  Bottom 0.305: 13.34,6.82 Q2.3
  Bottom 0.406: v63.5,13.34 63.5,15.24 55.24,15.24 55.24,22.23 v49.53,22.23 45.09,22.23 v45.09,29.84 | R11.1 11.74,31.75 10.79,31.75 | JP1.2 10.79,31.75 | 10.79,31.75 R12.2 | v37.47,52.07 31.75,52.07 31.75,59.69 JP5.2
  Bottom 0.61: 13.34,6.82 v13.34,4.45 2.54,4.45 2.54,31.75 JP1.2